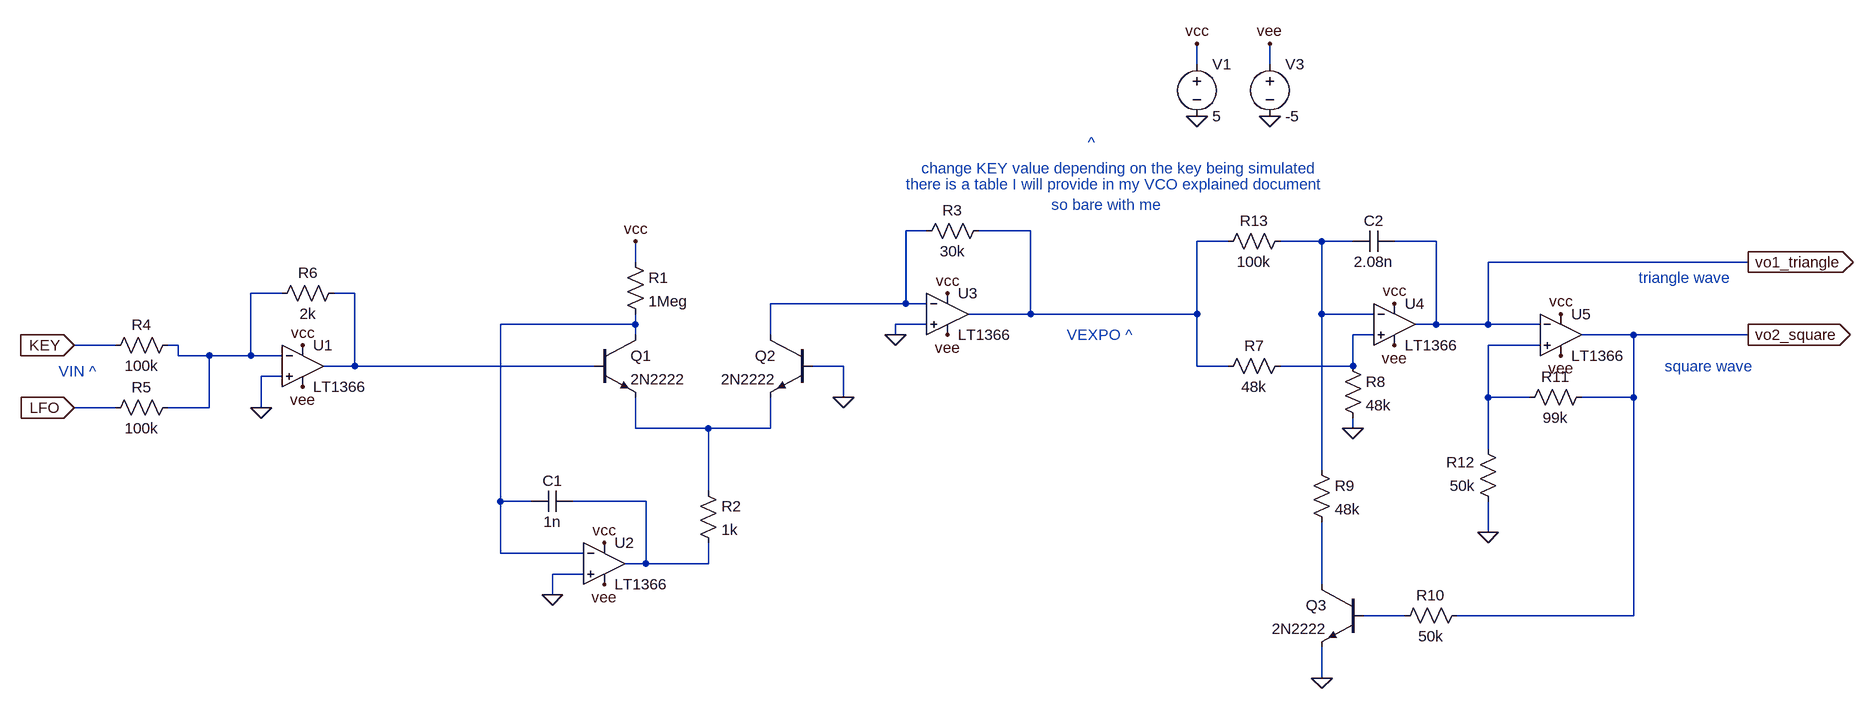
[diagram p0: schematic VCOComplete+exp_converter_block.asc]
VCOComplete+exp_converter_block.asc, the LTspice schematic file:
Version 4
SHEET 1 2112 680
WIRE 1056 -432 1056 -464
WIRE 1168 -432 1168 -464
WIRE 640 -176 608 -176
WIRE 800 -176 720 -176
WIRE 1104 -160 1056 -160
WIRE 1248 -160 1184 -160
WIRE 1296 -160 1248 -160
WIRE 1424 -160 1360 -160
WIRE 192 -128 192 -160
WIRE 1904 -128 1504 -128
WIRE -352 -80 -400 -80
WIRE -240 -80 -272 -80
WIRE 608 -64 608 -176
WIRE 608 -64 400 -64
WIRE 640 -64 608 -64
WIRE 800 -48 800 -176
WIRE 800 -48 704 -48
WIRE 1056 -48 1056 -160
WIRE 1056 -48 800 -48
WIRE 1248 -48 1248 -160
WIRE 1328 -48 1248 -48
WIRE 192 -32 192 -48
WIRE 192 -32 -16 -32
WIRE 640 -32 592 -32
WIRE 1424 -32 1424 -160
WIRE 1424 -32 1392 -32
WIRE 1504 -32 1504 -128
WIRE 1504 -32 1424 -32
WIRE 1584 -32 1504 -32
WIRE 192 -16 192 -32
WIRE 400 -16 400 -64
WIRE 592 -16 592 -32
WIRE 1328 -16 1296 -16
WIRE 1728 -16 1648 -16
WIRE 1904 -16 1728 -16
WIRE -608 0 -672 0
WIRE -512 0 -528 0
WIRE 1584 0 1504 0
WIRE -512 16 -512 0
WIRE -464 16 -512 16
WIRE -400 16 -400 -80
WIRE -400 16 -464 16
WIRE -352 16 -400 16
WIRE -240 32 -240 -80
WIRE -240 32 -288 32
WIRE 128 32 -240 32
WIRE 512 32 464 32
WIRE 1056 32 1056 -48
WIRE 1104 32 1056 32
WIRE 1296 32 1296 -16
WIRE 1296 32 1184 32
WIRE -352 48 -384 48
WIRE 512 80 512 32
WIRE 1504 80 1504 0
WIRE 1568 80 1504 80
WIRE 1728 80 1728 -16
WIRE 1728 80 1648 80
WIRE -608 96 -672 96
WIRE -464 96 -464 16
WIRE -464 96 -528 96
WIRE -384 96 -384 48
WIRE 192 128 192 80
WIRE 304 128 192 128
WIRE 400 128 400 80
WIRE 400 128 304 128
WIRE 1296 128 1296 112
WIRE 1504 160 1504 80
WIRE 1248 192 1248 -48
WIRE 304 224 304 128
WIRE -16 240 -16 -32
WIRE 32 240 -16 240
WIRE 208 240 96 240
WIRE 1504 288 1504 240
WIRE -16 320 -16 240
WIRE 112 320 -16 320
WIRE 208 336 208 240
WIRE 208 336 176 336
WIRE 304 336 304 304
WIRE 304 336 208 336
WIRE 112 352 64 352
WIRE 1248 368 1248 272
WIRE 64 384 64 352
WIRE 1376 416 1312 416
WIRE 1728 416 1728 80
WIRE 1728 416 1456 416
WIRE 1248 512 1248 464
FLAG 512 80 0
FLAG 192 -160 vcc
FLAG 64 384 0
FLAG 592 -16 0
FLAG 672 -80 vcc
FLAG 1056 -352 0
FLAG 1056 -464 vcc
FLAG 1168 -352 0
FLAG 1168 -464 vee
FLAG 672 -16 vee
FLAG 144 304 vcc
FLAG 144 368 vee
FLAG -320 0 vcc
FLAG -384 96 0
FLAG -672 0 KEY
IOPIN -672 0 In
FLAG -672 96 LFO
IOPIN -672 96 In
FLAG 1360 -64 vcc
FLAG 1616 -48 vcc
FLAG 1904 -128 vo1_triangle
IOPIN 1904 -128 Out
FLAG 1904 -16 vo2_square
IOPIN 1904 -16 Out
FLAG 1296 128 0
FLAG 1248 512 0
FLAG 1504 288 0
FLAG 1616 16 vee
FLAG 1360 0 vee
FLAG -320 64 vee
SYMBOL res 176 -144 R0
SYMATTR InstName R1
SYMATTR Value 1Meg
SYMBOL cap 96 224 R90
WINDOW 0 0 32 VBottom 2
WINDOW 3 32 32 VTop 2
SYMATTR InstName C1
SYMATTR Value 1n
SYMBOL res 288 208 R0
SYMATTR InstName R2
SYMATTR Value 1k
SYMBOL res 736 -192 R90
WINDOW 0 0 56 VBottom 2
WINDOW 3 32 56 VTop 2
SYMATTR InstName R3
SYMATTR Value 30k
SYMBOL voltage 1056 -448 R0
SYMATTR InstName V1
SYMATTR Value 5
SYMBOL voltage 1168 -448 R0
SYMATTR InstName V3
SYMATTR Value -5
SYMBOL res -512 -16 R90
WINDOW 0 0 56 VBottom 2
WINDOW 3 32 56 VTop 2
SYMATTR InstName R4
SYMATTR Value 100k
SYMBOL res -512 80 R90
WINDOW 0 0 56 VBottom 2
WINDOW 3 32 56 VTop 2
SYMATTR InstName R5
SYMATTR Value 100k
SYMBOL res -256 -96 R90
WINDOW 0 0 56 VBottom 2
WINDOW 3 32 56 VTop 2
SYMATTR InstName R6
SYMATTR Value 2k
SYMBOL cap 1360 -176 R90
WINDOW 0 0 32 VBottom 2
WINDOW 3 32 32 VTop 2
SYMATTR InstName C2
SYMATTR Value 2.08n
SYMBOL res 1200 16 R90
WINDOW 0 0 56 VBottom 2
WINDOW 3 32 56 VTop 2
SYMATTR InstName R7
SYMATTR Value 48k
SYMBOL res 1280 16 R0
SYMATTR InstName R8
SYMATTR Value 48k
SYMBOL res 1232 176 R0
SYMATTR InstName R9
SYMATTR Value 48k
SYMBOL npn 1312 368 M0
SYMATTR InstName Q3
SYMATTR Value 2N2222
SYMBOL res 1472 400 R90
WINDOW 0 0 56 VBottom 2
WINDOW 3 32 56 VTop 2
SYMATTR InstName R10
SYMATTR Value 50k
SYMBOL res 1664 64 R90
WINDOW 0 0 56 VBottom 2
WINDOW 3 32 56 VTop 2
SYMATTR InstName R11
SYMATTR Value 99k
SYMBOL res 1520 256 R180
WINDOW 0 36 76 Left 2
WINDOW 3 36 40 Left 2
SYMATTR InstName R12
SYMATTR Value 50k
SYMBOL res 1200 -176 R90
WINDOW 0 0 56 VBottom 2
WINDOW 3 32 56 VTop 2
SYMATTR InstName R13
SYMATTR Value 100k
SYMBOL npn 128 -16 R0
SYMATTR InstName Q1
SYMATTR Value 2N2222
SYMBOL npn 464 -16 M0
SYMATTR InstName Q2
SYMATTR Value 2N2222
SYMBOL Opamps\\LT1366 -320 -32 R0
SYMATTR InstName U1
SYMBOL Opamps\\LT1366 144 272 R0
SYMATTR InstName U2
SYMBOL Opamps\\LT1366 672 -112 R0
SYMATTR InstName U3
SYMBOL Opamps\\LT1366 1360 -96 R0
SYMATTR InstName U4
SYMBOL Opamps\\LT1366 1616 -80 R0
SYMATTR InstName U5
TEXT 856 -16 Left 2 ;VEXPO ^
TEXT -696 40 Left 2 ;VIN ^
TEXT 1776 32 Left 2 ;square wave
TEXT 1736 -104 Left 2 ;triangle wave
TEXT 632 -272 Left 2 ;change KEY value depending on the key being simulated
TEXT 888 -312 Left 2 ;^
TEXT 608 -248 Left 2 ;there is a table I will provide in my VCO explained document
TEXT 832 -216 Left 2 ;so bare with me

The netlist it stands for:
* VCOComplete+exp_converter_block.asc
R1 vcc N006 1Meg
C1 N010 N006 1n
R2 N009 N010 1k
R3 N002 N001 30k
V1 vcc 0 5
V3 vee 0 -5
R4 N004 KEY 100k
R5 N004 LFO 100k
R6 N005 N004 2k
C2 vo1_triangle N003 2.08n
R7 N007 N002 48k
R8 N007 0 48k
R9 N003 N011 48k
Q3 N011 N012 0 0 2N2222
R10 vo2_square N012 50k
R11 vo2_square N008 99k
R12 0 N008 50k
R13 N003 N002 100k
Q1 N006 N005 N009 0 2N2222
Q2 N001 0 N009 0 2N2222
XU1 0 N004 vcc vee N005 LT1366  ; pins In+ In- V+ V- OUT
XU2 0 N006 vcc vee N010 LT1366  ; pins In+ In- V+ V- OUT
XU3 0 N001 vcc vee N002 LT1366  ; pins In+ In- V+ V- OUT
XU4 N007 N003 vcc vee vo1_triangle LT1366  ; pins In+ In- V+ V- OUT
XU5 N008 vo1_triangle vcc vee vo2_square LT1366  ; pins In+ In- V+ V- OUT
.model NPN NPN
.model PNP PNP
.lib standard.bjt
* VEXPO ^
* VIN ^
* square wave
* triangle wave
* change KEY value depending on the key being simulated
* ^
* there is a table I will provide in my VCO explained document
* so bare with me
.lib LTC.lib
.backanno
.end